# EAGLE design wctl_relays (EAGLE 9.6.2)
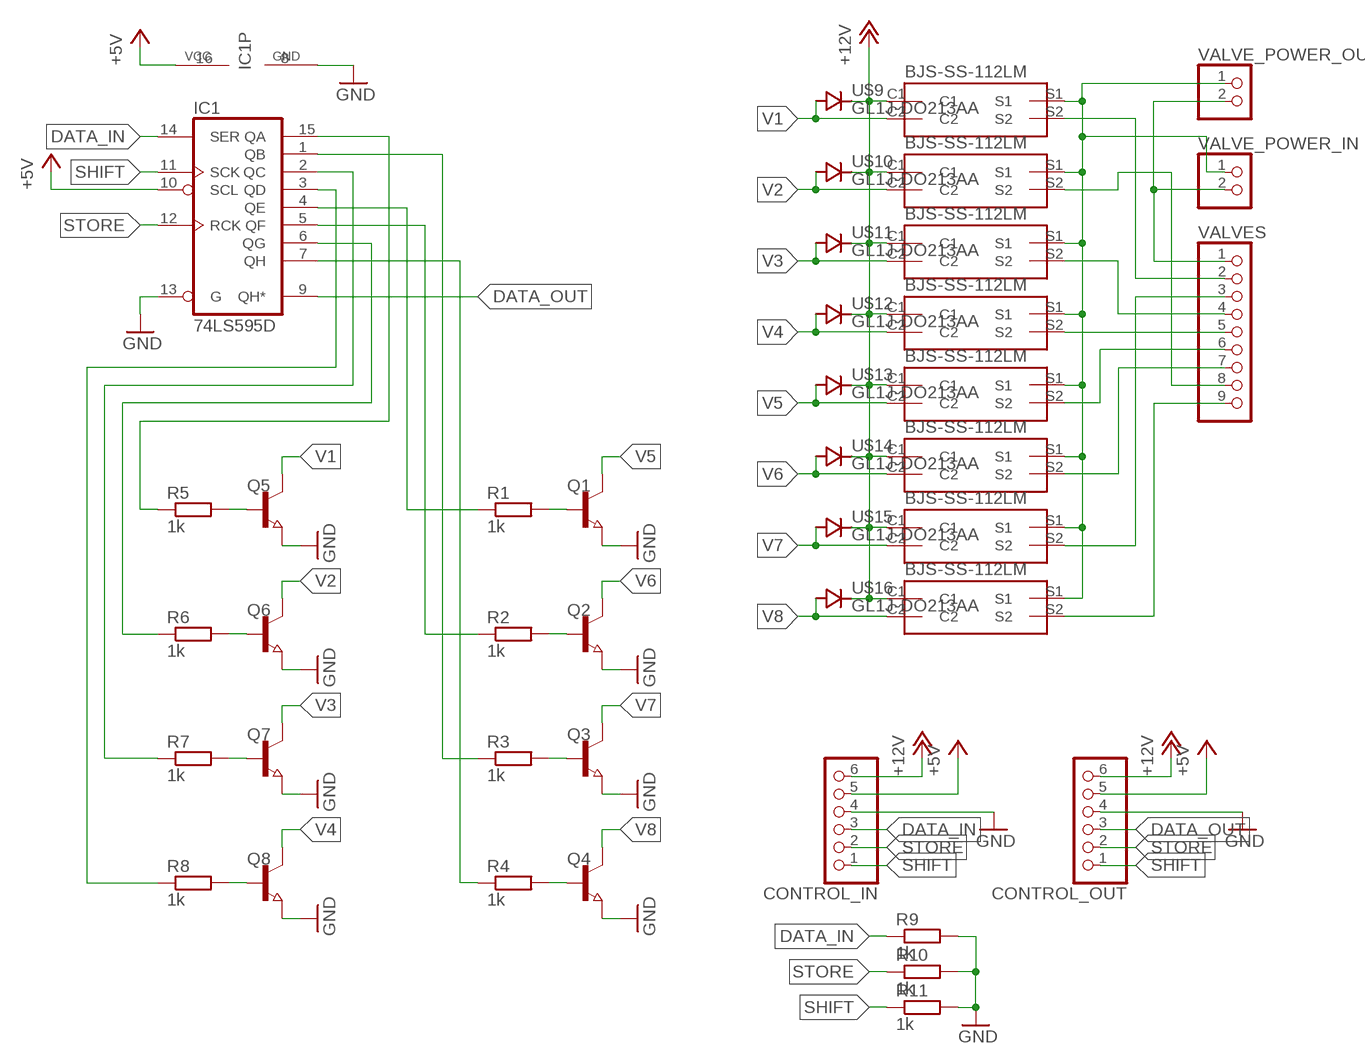
[diagram p0: schematic, sheet 1]

## Parts
CONTROL_IN  PINHD-1X6  [1X06]
CONTROL_OUT  PINHD-1X6  [1X06]
IC1  74LS595D  [SO16]
Q1  NPN-TRANSISTOR_SOT23  [SOT23]
Q2  NPN-TRANSISTOR_SOT23  [SOT23]
Q3  NPN-TRANSISTOR_SOT23  [SOT23]
Q4  NPN-TRANSISTOR_SOT23  [SOT23]
Q5  NPN-TRANSISTOR_SOT23  [SOT23]
Q6  NPN-TRANSISTOR_SOT23  [SOT23]
Q7  NPN-TRANSISTOR_SOT23  [SOT23]
Q8  NPN-TRANSISTOR_SOT23  [SOT23]
R1  1k  R-EU_R0603  [R0603]
R2  1k  R-EU_R0603  [R0603]
R3  1k  R-EU_R0603  [R0603]
R4  1k  R-EU_R0603  [R0603]
R5  1k  R-EU_R0603  [R0603]
R6  1k  R-EU_R0603  [R0603]
R7  1k  R-EU_R0603  [R0603]
R8  1k  R-EU_R0603  [R0603]
R9  1k  R-EU_R0603  [R0603]
R10  1k  R-EU_R0603  [R0603]
R11  1k  R-EU_R0603  [R0603]
U$1  BJS-SS-112LM  [BJS-SS-112LM]
U$2  BJS-SS-112LM  [BJS-SS-112LM]
U$3  BJS-SS-112LM  [BJS-SS-112LM]
U$4  BJS-SS-112LM  [BJS-SS-112LM]
U$5  BJS-SS-112LM  [BJS-SS-112LM]
U$6  BJS-SS-112LM  [BJS-SS-112LM]
U$7  BJS-SS-112LM  [BJS-SS-112LM]
U$8  BJS-SS-112LM  [BJS-SS-112LM]
U$9  GL1J-DO213AA  [GL1J-DO213AA]
U$10  GL1J-DO213AA  [GL1J-DO213AA]
U$11  GL1J-DO213AA  [GL1J-DO213AA]
U$12  GL1J-DO213AA  [GL1J-DO213AA]
U$13  GL1J-DO213AA  [GL1J-DO213AA]
U$14  GL1J-DO213AA  [GL1J-DO213AA]
U$15  GL1J-DO213AA  [GL1J-DO213AA]
U$16  GL1J-DO213AA  [GL1J-DO213AA]
VALVE_POWER_IN  PINHD-1X2  [1X02]
VALVE_POWER_OUT  PINHD-1X2  [1X02]
VALVES  PINHD-1X9  [1X09]

## Nets
+5V: CONTROL_IN.5 CONTROL_OUT.5 IC1.10(SCL) IC1.16(VCC)
+12V: CONTROL_IN.6 CONTROL_OUT.6 U$1.C1 U$2.C1 U$3.C1 U$4.C1 U$5.C1 U$6.C1 U$7.C1 U$8.C1 U$9.C U$10.C U$11.C U$12.C U$13.C U$14.C U$15.C U$16.C
DATA_IN: CONTROL_IN.3 IC1.14(SER) R9.1
DATA_OUT: CONTROL_OUT.3 IC1.9(QH*)
GND: CONTROL_IN.4 CONTROL_OUT.4 IC1.8(GND) IC1.13(G) Q1.2(E) Q2.2(E) Q3.2(E) Q4.2(E) Q5.2(E) Q6.2(E) Q7.2(E) Q8.2(E) R9.2 R10.2 R11.2
N$1: U$2.S2 VALVES.8
N$2: U$4.S2 VALVES.5
N$3: U$5.S2 VALVES.6
N$4: U$6.S2 VALVES.7
N$5: U$7.S2 VALVES.3
N$6: U$8.S2 VALVES.9
N$7: U$3.S2 VALVES.4
N$9: U$1.S2 VALVES.2
N$10: VALVE_POWER_IN.2 VALVE_POWER_OUT.2 VALVES.1
N$11: Q1.1(B) R1.2
N$12: Q2.1(B) R2.2
N$13: Q3.1(B) R3.2
N$14: Q4.1(B) R4.2
N$15: Q5.1(B) R5.2
N$16: Q6.1(B) R6.2
N$17: Q7.1(B) R7.2
N$18: Q8.1(B) R8.2
N$19: IC1.15(QA) R5.1
N$20: IC1.6(QG) R6.1
N$21: IC1.2(QC) R7.1
N$22: IC1.3(QD) R8.1
N$23: IC1.4(QE) R1.1
N$24: IC1.5(QF) R2.1
N$25: IC1.1(QB) R3.1
N$26: IC1.7(QH) R4.1
N$27: U$1.S1 U$2.S1 U$3.S1 U$4.S1 U$5.S1 U$6.S1 U$7.S1 U$8.S1 VALVE_POWER_IN.1 VALVE_POWER_OUT.1
SHIFT: CONTROL_IN.1 CONTROL_OUT.1 IC1.11(SCK) R11.1
STORE: CONTROL_IN.2 CONTROL_OUT.2 IC1.12(RCK) R10.1
V1: Q5.3(C) U$1.C2 U$9.A
V2: Q6.3(C) U$2.C2 U$10.A
V3: Q7.3(C) U$3.C2 U$11.A
V4: Q8.3(C) U$4.C2 U$12.A
V5: Q1.3(C) U$5.C2 U$13.A
V6: Q2.3(C) U$6.C2 U$14.A
V7: Q3.3(C) U$7.C2 U$15.A
V8: Q4.3(C) U$8.C2 U$16.A

## Library data of the parts
CONTROL_IN CONTROL_OUT = pinhead:PINHD-1X6: PIN HEADER
IC1 = 74xx-us:74*595: 8-bit SHIFT REGISTER, output latch
Q1-Q8 = semicon-smd-ipc:NPN-TRANSISTOR_: NPN TRANSISTOR
R1-R11 = rcl:R-EU_: RESISTOR, European symbol; SPICEPREFIX: R
U$1-U$8 = bjs-ss-112lm:BJS-SS-112LM
U$9-U$16 = gl1j-do213aa:GL1J-DO213AA
VALVE_POWER_IN VALVE_POWER_OUT = pinhead:PINHD-1X2: PIN HEADER
VALVES = pinhead:PINHD-1X9: PIN HEADER

## Board
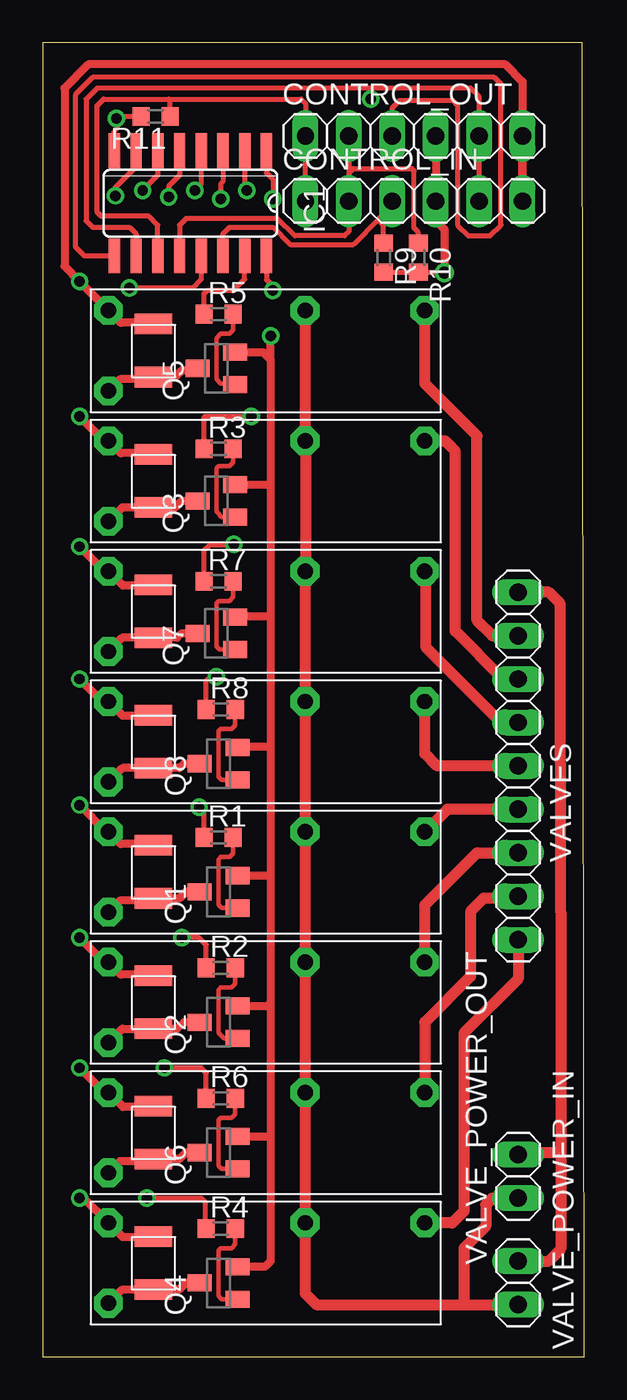
[diagram p1: board, top side]
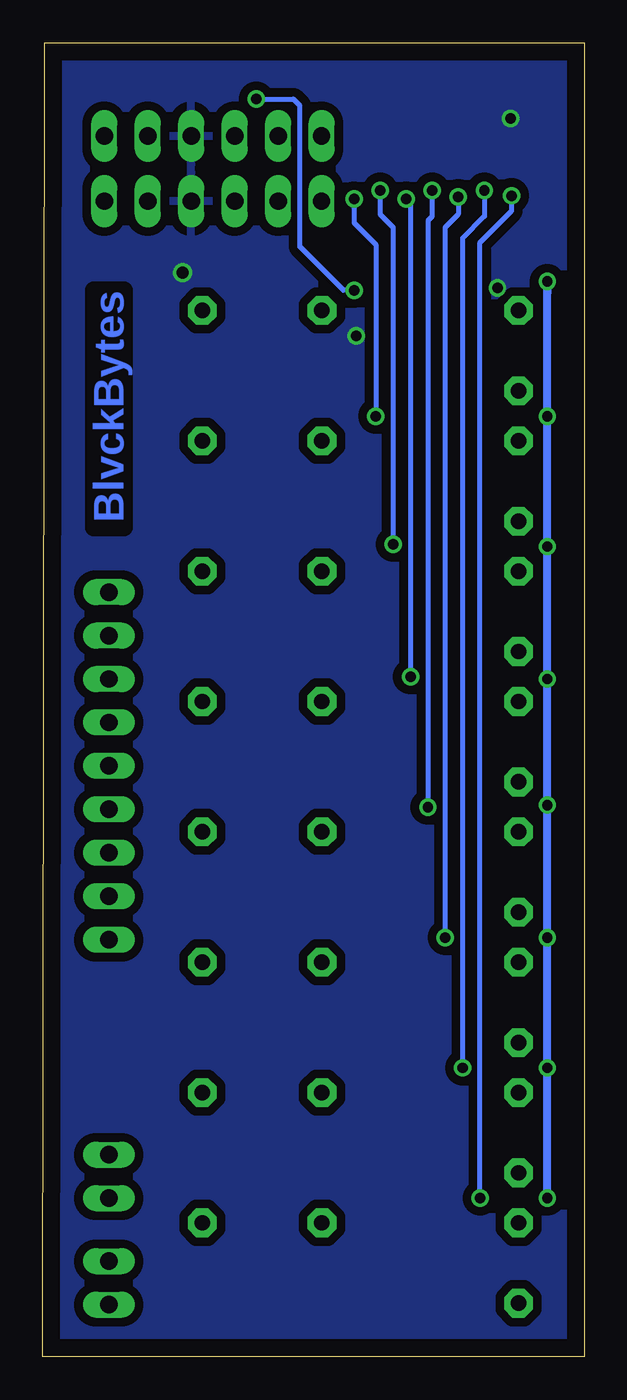
[diagram p2: board, bottom side, seen from below]

Size 31.67 x 76.82 mm. Coordinates in mm from the lower left corner, seen from the top.
Outline: 0,0 31.67,0 31.55,76.82 0,76.82 0,0
Copper layers (1*16): Top 0.035mm / dielectric 1.5mm / Bottom 0.035mm
Design rules "default *": minimum track width 6mil, minimum drill 0.35mm, track to track 6mil, track to pad 6mil, pad to pad 6mil, via to via 6mil, smd to smd 6mil, copper to edge 40mil, drill to drill 6mil, minimum pad ring 10mil, minimum via ring 8mil, stop-mask expansion 4mil, vias tented up to drill 0mil, thermal gap 20mil

### Footprints (pad centres in the part's own frame; a part is rotated, then mirrored left to right if it is on the bottom)
1X06 = drill 1.016 long: 1 -6.35,0; 2 -3.81,0; 3 -1.27,0; 4 1.27,0; 5 3.81,0; 6 6.35,0
SO16 = smd 0.66 x 2.032: 1 -4.445,-3.073; 2 -3.175,-3.073; 3 -1.905,-3.073; 4 -0.635,-3.073; 5 0.635,-3.073; 6 1.905,-3.073; 7 3.175,-3.073; 8 4.445,-3.073; 9 4.445,3.073; 10 3.175,3.073; 11 1.905,3.073; 12 0.635,3.073; 13 -0.635,3.073; 14 -1.905,3.073; 15 -3.175,3.073; 16 -4.445,3.073
SOT23 = smd 1 x 1.4: 1 -0.95,-1.1; 2 0.95,-1.1; 3 0,1.1
R0603 = smd 1 x 1.1: 1 -0.85,0; 2 0.85,0
BJS-SS-112LM = drill 0.9 pad 1.676 octagon: C1 1.05,5.925; C2 1.05,1.225; S1 12.55,5.925; S2 19.55,5.925
GL1J-DO213AA = smd 1.2 x 2.184: A 0,0; C 3.1,0
1X02 = drill 1.016 long: 1 -1.27,0; 2 1.27,0
1X09 = drill 1.016 long: 1 -10.16,0; 2 -7.62,0; 3 -5.08,0; 4 -2.54,0; 5 0,0; 6 2.54,0; 7 5.08,0; 8 7.62,0; 9 10.16,0

### Placement (x,y rotation side)
CONTROL_IN  21.72,67.56 0 top
CONTROL_OUT  21.72,71.37 0 top
IC1  8.64,67.44 180 top
Q1  10.29,27.18 90 top
Q2  10.29,19.56 90 top
Q3  10.16,50.04 90 top
Q4  10.29,4.32 90 top
Q5  10.16,57.79 90 top
Q6  10.29,11.94 90 top
Q7  10.16,42.29 90 top
Q8  10.29,34.67 90 top
R1  10.29,30.35 0 top
R2  10.41,22.73 0 top
R3  10.29,53.09 0 top
R4  10.41,7.49 0 top
R5  10.29,60.96 0 top
R6  10.41,15.11 0 top
R7  10.29,45.34 0 top
R8  10.41,37.85 0 top
R9  19.94,64.26 270 top
R10  21.97,64.26 270 top
R11  6.6,72.52 180 top
U$1  2.79,55.24 0 top
U$2  2.79,9.53 0 top
U$3  2.79,40.01 0 top
U$4  2.79,32.38 0 top
U$5  2.79,24.77 0 top
U$6  2.79,17.15 0 top
U$7  2.79,47.62 0 top
U$8  2.79,1.9 0 top
U$9  6.48,57.28 90 top
U$10  6.48,11.56 90 top
U$11  6.48,42.04 90 top
U$12  6.48,34.42 90 top
U$13  6.48,26.8 90 top
U$14  6.48,19.18 90 top
U$15  6.48,49.66 90 top
U$16  6.48,3.94 90 top
VALVE_POWER_IN  27.81,4.32 90 top
VALVE_POWER_OUT  27.81,10.54 90 top
VALVES  27.81,34.54 270 top

### Tracks (layer width: path | path; a pad name or v marks a point on that pad's centre or on a via)
+5V  (via drill 0.61)
  Top 0.305: IC1.10 5.46,65.66 5.08,66.04 2.92,66.04 2.54,66.42 2.54,73.53 3.18,74.17 19.18,74.17 | 19.18,74.17 25.02,74.17 25.53,73.66 CONTROL_IN.5 CONTROL_OUT.5 | IC1.16 13.08,62.97 13.46,62.59 v13.46,62.36 | 19.18,74.17 v19.18,73.53
  Bottom 0.305: v13.46,62.36 14.1,62.36 16.64,64.9 16.64,73.15 17.02,73.53 v19.18,73.53
+12V  (via drill 0.61)
  Top 0.457: U$11.C 6.43,45.09 4.69,45.09 U$3.C1 3.59,45.93 2.16,47.36 v2.16,47.37 | U$12.C 6.43,37.47 4.69,37.47 U$4.C1 3.47,38.31 v2.16,39.62 | U$15.C 6.48,52.83 4.56,52.83 U$7.C1 3.59,53.55 2.16,54.98 v2.16,54.99 | U$14.C 6.4,22.35 4.56,22.35 U$6.C1 3.59,23.07 2.16,24.5 v2.16,24.51 | U$13.C 6.48,29.97 4.56,29.97 U$5.C1 3.72,30.69 v2.16,32.25 v2.16,32.26 | U$16.C 6.43,6.99 4.69,6.99 U$8.C1 2.4,9.27 v2.16,9.27 | U$9.C 6.48,60.45 4.56,60.45 U$1.C1 v2.16,62.85 v2.16,62.87 1.27,63.75 1.27,74.17 2.67,75.56 27.05,75.56 28.07,74.55 CONTROL_IN.6 CONTROL_OUT.6 | U$10.C 6.43,14.6 4.69,14.6 U$2.C1 3.6,15.45 v2.16,16.89
  Bottom 0.457: v2.16,9.27 v2.16,16.89 v2.16,24.51 v2.16,32.26 v2.16,39.62 v2.16,47.37 v2.16,54.99 v2.16,62.87 2.16,62.23
DATA_IN
  Top 0.305: IC1.14 10.54,65.66 10.92,66.04 13.46,66.04 14.48,65.02 18.16,65.02 19.62,66.48 | 19.62,66.48 20.45,67.31 CONTROL_IN.3 | R9.1 19.94,66.17 19.62,66.48
DATA_OUT
  Top 0.305: CONTROL_OUT.3 20.45,73.02 20.88,73.46 23.95,73.46 24.26,73.15 24.26,66.17 24.89,65.53 26.16,65.53 26.8,66.17 26.8,74.42 26.42,74.8 2.92,74.8 1.91,73.79 1.91,64.9 2.44,64.36 IC1.9
GND  (via drill 0.61, 0.7)
  Top 0.305: IC1.8 4.19,71.65 4.32,71.78 v4.32,72.39 4.45,72.52 R11.2 | IC1.13 9.27,62.99 8.76,62.48 v5.08,62.48 | R9.2 R10.2 23.46,63.41 v23.5,63.37
  Top 0.457: Q5.2 12.89,58.74 13.34,58.29 | 13.34,58.29 13.34,50.99 | Q3.2 13.34,50.99 | 13.34,50.99 13.34,43.31 | 13.34,43.31 13.34,35.69 | 13.34,35.69 13.34,28.19 | 13.34,28.19 13.34,20.7 | 13.34,20.7 13.34,12.95 | 13.34,12.95 13.34,5.59 13.02,5.27 Q4.2 | Q6.2 13.27,12.89 13.34,12.95 | Q2.2 13.14,20.51 13.34,20.7 | Q1.2 13.27,28.13 13.34,28.19 | Q8.2 11.45,35.69 13.34,35.69 | Q7.2 11.33,43.31 13.34,43.31 | CONTROL_OUT.4 CONTROL_IN.4 22.99,66.42 23.5,65.91 v23.5,63.37 | 13.34,58.29 v13.34,59.69
  pour Bottom (isolate 0.508): 0.25,76.83 0.25,0 31.37,0 31.37,76.83
N$1
  Top 0.635: VALVES.8 27.69,26.8 25.78,26.8 25.02,26.04 25.02,22.23 22.34,19.55 U$2.S2
N$2
  Top 0.635: VALVES.5 23.06,34.54 22.34,35.26 U$4.S2
N$3
  Top 0.635: VALVES.6 23.66,32 U$5.S2
N$4
  Top 0.635: U$6.S2 22.34,26.41 25.4,29.46 VALVES.7
N$5
  Top 0.635: U$7.S2 23.54,53.55 24.13,52.96 24.13,42.42 26.92,39.62 VALVES.3
N$6
  Top 0.635: VALVES.9 27.81,22.1 24.64,18.92 24.64,8.51 23.96,7.83 U$8.S2
N$7
  Top 0.635: VALVES.4 26.8,37.08 22.41,41.47 22.41,45.86 U$3.S2
N$9
  Top 0.635: VALVES.2 26.29,42.16 25.4,43.05 25.4,53.85 22.34,56.9 U$1.S2
N$10
  Top 0.635: VALVE_POWER_IN.2 29.59,5.59 30.3,6.29 30.3,11.94 | 30.27,43.43 30.3,26.04 30.3,11.94 | 30.27,43.43 | 30.27,43.43 30.27,44.03 29.59,44.7 VALVES.1 | VALVE_POWER_OUT.2 27.94,11.94 30.3,11.94
N$11
  Top 0.254: Q1.1 10.48,26.23 10.29,26.42 10.29,29.08 10.41,29.21 10.92,29.21 11.14,29.43 R1.2
N$12
  Top 0.254: Q2.1 10.6,18.61 10.29,18.92 10.29,21.46 10.41,21.59 11.05,21.59 11.26,21.8 R2.2
N$13
  Top 0.254: Q3.1 10.48,49.09 10.16,49.4 10.16,51.94 10.29,52.07 10.92,52.07 11.14,52.29 R3.2
N$14
  Top 0.254: Q4.1 10.48,3.37 10.29,3.56 10.29,6.22 10.41,6.35 11.05,6.35 11.26,6.56 R4.2
N$15
  Top 0.254: 11.2,56.9 10.41,56.9 10.16,57.15 10.16,59.56 10.41,59.82 10.92,59.82 11.14,60.03 R5.2
  Top 0.305: Q5.1 11.2,56.9
N$16
  Top 0.254: Q6.1 10.48,10.99 10.29,11.18 10.29,13.84 10.41,13.97 11.05,13.97 11.26,14.19 R6.2
N$17
  Top 0.254: Q7.1 10.35,41.34 10.16,41.53 10.16,44.07 10.29,44.2 10.92,44.2 11.14,44.41 R7.2
N$18
  Top 0.254: Q8.1 10.48,33.72 10.29,33.91 10.29,36.58 10.41,36.7 11.05,36.7 11.26,36.92 R8.2
N$19
  Top 0.305: R5.1 9.44,62.14 9.65,62.36 11.18,62.36 11.81,62.99 IC1.15
N$20  (via drill 0.61)
  Top 0.305: R6.1 9.56,16.6 9.27,16.89 v7.11,16.89 | IC1.6 6.73,69.09 v5.84,68.2
  Bottom 0.305: v5.84,68.2 5.84,66.67 7.11,65.41 v7.11,16.89
N$21  (via drill 0.61)
  Top 0.305: R7.1 9.44,47.16 9.78,47.5 v11.18,47.5 | IC1.2 11.81,68.33 v11.94,68.2
  Bottom 0.305: v11.94,68.2 11.94,66.8 11.18,66.04 v11.18,47.5
N$22  (via drill 0.61)
  Top 0.305: 9.52,37.81 R8.1 9.56,39.54 9.78,39.75 v10.16,39.75 | IC1.3 10.54,68.71 10.41,68.58 v10.41,67.69
  Bottom 0.305: v10.41,67.69 10.16,67.44 v10.16,39.75
N$23  (via drill 0.61)
  Top 0.305: R1.1 9.44,31.84 v9.14,32.13 | IC1.4 9.27,68.58 v8.89,68.2
  Bottom 0.305: v8.89,68.2 8.89,66.67 9.14,66.42 v9.14,32.13
N$24  (via drill 0.61)
  Top 0.305: R2.1 9.56,24.09 9.14,24.51 v8.13,24.51 | IC1.5 8,69.09 7.37,68.45 v7.37,67.82
  Bottom 0.305: v8.13,24.51 8.13,66.04 7.37,66.8 v7.37,67.82
N$25  (via drill 0.61)
  Top 0.305: R3.1 9.44,54.9 9.52,54.99 v12.19,54.99 | IC1.1 13.08,69.21 13.46,68.83 v13.46,67.69
  Bottom 0.305: v13.46,67.69 13.46,66.29 12.19,65.02 v12.19,54.99
N$26  (via drill 0.61)
  Top 0.305: R4.1 9.52,7.53 9.52,9.02 9.27,9.27 v6.1,9.27 | IC1.7 5.4,70.45 5.4,69.53 4.25,68.39 v4.25,67.88
  Bottom 0.305: v4.25,67.88 4.25,66.99 6.1,65.15 v6.1,9.27
N$27
  Top 0.635: 15.37,61.19 U$1.S1 | U$1.S1 U$7.S1 15.37,53.53 15.37,45.95 U$3.S1 U$4.S1 U$5.S1 U$6.S1 U$2.S1 U$8.S1 | U$8.S1 15.37,7.81 | U$1.S1 15.45,61.17 | U$8.S1 15.34,3.71 16,3.05 24.64,3.05 | 24.64,3.05 VALVE_POWER_IN.1 | VALVE_POWER_OUT.1 26.29,9.27 25.91,8.89 25.91,7.62 24.64,6.35 24.64,3.05
SHIFT
  Top 0.305: CONTROL_IN.1 CONTROL_OUT.1 15.37,73.28 15.11,73.53 7.37,73.53 | IC1.11 6.73,66.17 6.22,66.67 3.43,66.67 3.18,66.93 3.18,73.15 3.56,73.53 7.37,73.53 | R11.1 7.45,73.44 7.37,73.53
STORE
  Top 0.305: CONTROL_OUT.2 17.91,69.21 | 17.91,69.21 CONTROL_IN.2 | 17.91,67.82 CONTROL_IN.2 | CONTROL_IN.2 17.91,65.79 17.65,65.53 14.73,65.53 13.72,66.55 8.38,66.55 8,66.17 IC1.12 | 17.91,69.21 18.16,69.47 21.59,69.47 21.72,69.34 21.72,66 21.97,65.75 R10.1
V1
  Top 0.457: U$1.C2 4.52,57.15 6.48,57.15 U$9.A 7.75,57.28 8.13,57.66 8.93,57.66 Q5.3
V2
  Top 0.457: U$2.C2 4.52,11.43 6.35,11.43 U$10.A 8,11.56 8.38,11.94 Q6.3
V3
  Top 0.457: U$3.C2 4.65,42.04 U$11.A 7.87,42.04 8.13,42.29 Q7.3 9.02,42.25
V4
  Top 0.457: U$4.C2 4.65,34.42 U$12.A 8,34.42 8.26,34.67 Q8.3
V5
  Top 0.457: U$5.C2 4.52,26.67 6.48,26.67 U$13.A 8,26.8 8.38,27.18 Q1.3
V6
  Top 0.457: U$6.C2 4.65,19.18 U$14.A 7.87,19.18 8.26,19.56 Q2.3
V7
  Top 0.457: U$7.C2 4.65,49.66 U$15.A 7.75,49.66 8.13,50.04 Q3.3
V8
  Top 0.457: U$8.C2 4.65,3.94 U$16.A 8,3.94 8.38,4.32 Q4.3

### Text on the board
Bottom: BlvckBytes